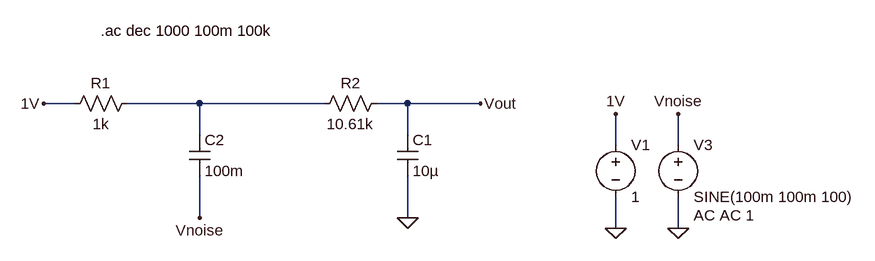
[diagram p0: schematic noise_simulation.asc]
noise_simulation.asc, the LTspice schematic file:
Version 4
SHEET 1 1160 680
WIRE -528 144 -576 144
WIRE -336 144 -448 144
WIRE -144 144 -336 144
WIRE -16 144 -64 144
WIRE 96 144 -16 144
WIRE -336 192 -336 144
WIRE -16 192 -16 144
WIRE 304 208 304 160
WIRE 400 208 400 160
WIRE -336 320 -336 256
WIRE -16 320 -16 256
WIRE 304 336 304 288
WIRE 400 336 400 288
FLAG -16 320 0
FLAG 400 160 Vnoise
FLAG 400 336 0
FLAG 96 144 Vout
FLAG 304 160 1V
FLAG 304 336 0
FLAG -336 320 Vnoise
FLAG -576 144 1V
SYMBOL res -48 128 R90
WINDOW 0 0 56 VBottom 2
WINDOW 3 32 56 VTop 2
SYMATTR InstName R2
SYMATTR Value 10.61k
SYMBOL voltage 400 192 R0
WINDOW 123 24 124 Left 2
WINDOW 39 0 0 Left 0
SYMATTR Value2 AC AC 1
SYMATTR InstName V3
SYMATTR Value SINE(100m 100m 100)
SYMBOL voltage 304 192 R0
WINDOW 123 0 0 Left 0
WINDOW 39 0 0 Left 0
SYMATTR InstName V1
SYMATTR Value 1
SYMBOL cap -32 192 R0
SYMATTR InstName C1
SYMATTR Value 10µ
SYMBOL cap -352 192 R0
SYMATTR InstName C2
SYMATTR Value 100m
SYMBOL res -432 128 R90
WINDOW 0 0 56 VBottom 2
WINDOW 3 32 56 VTop 2
SYMATTR InstName R1
SYMATTR Value 1k
TEXT -488 32 Left 2 !.ac dec 1000 100m 100k

The netlist it stands for:
* noise_simulation.asc
R2 Vout N001 10.61k
V3 Vnoise 0 SINE(100m 100m 100) AC AC 1
V1 1V 0 1
C1 Vout 0 10µ
C2 N001 Vnoise 100m
R1 N001 1V 1k
.ac dec 1000 100m 100k
.backanno
.end

* Results of the author's LTspice run, read from the files saved beside the schematic
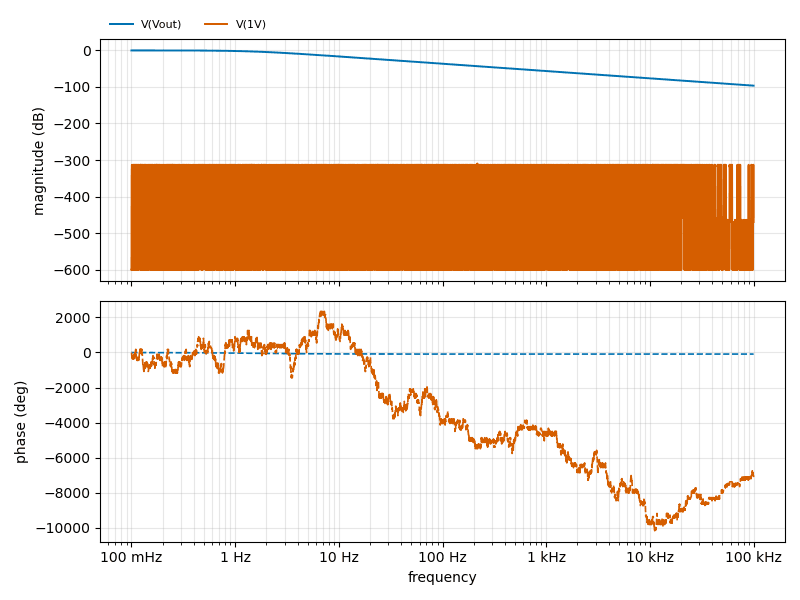
[diagram p1: AC Analysis of noise_simulation.asc, plotted from the saved traces]
* AC Analysis, 1 run:
*   V(Vout): -0.02 dB at 100 mHz, -96.48 dB at 100 kHz, peak -0.02 dB at 100 mHz, 3 dB below the peak at 1.507 Hz
*   V(1V): -600.00 dB at 100 mHz, -469.61 dB at 100 kHz, peak -309.55 dB at 216.8 Hz, 3 dB below the peak at 216.6 Hz and 216.8 Hz